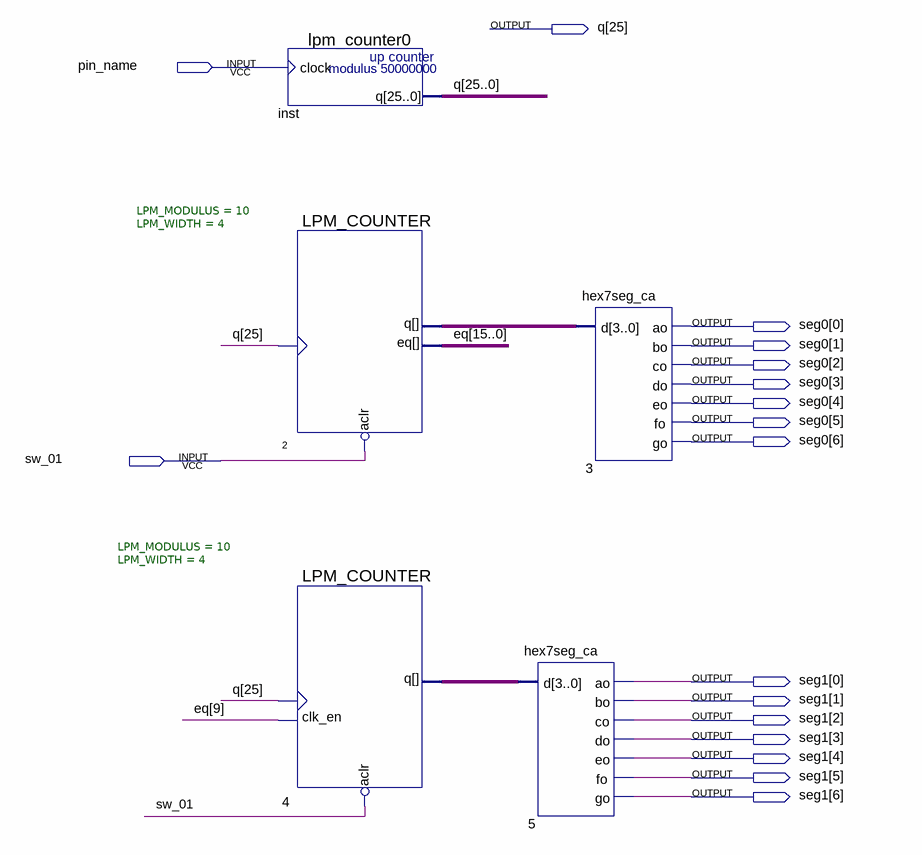
[diagram p0: schematic sheet]
// Quartus schematic lpm_lab_02.bdf as structural Verilog: 5 symbols, 17 pins
module lpm_lab_02 (
  input  pin_name,
  input  sw_01,
  output [25:0] q,
  output [6:0] seg0,
  output [6:0] seg1
);

  wire [3:0] n2_q, n4_q;
  wire [15:0] eq;

  lpm_counter0 inst (.clock(pin_name), .q(q));
  LPM_COUNTER #(.LPM_MODULUS(10), .LPM_WIDTH(4)) u_2 (.clock(q[25]), .aclr(~sw_01), .q(n2_q), .eq(eq));
  LPM_COUNTER #(.LPM_MODULUS(10), .LPM_WIDTH(4)) u_4 (.clock(q[25]), .clk_en(eq[9]), .aclr(~sw_01), .q(n4_q));
  hex7seg_ca u_5 (
    .d(n4_q), .ao(seg1[0]), .bo(seg1[1]), .co(seg1[2]), .\do (seg1[3]), .eo(seg1[4]), .fo(seg1[5]),
    .go(seg1[6]));
  hex7seg_ca u_3 (
    .d(n2_q), .ao(seg0[0]), .bo(seg0[1]), .co(seg0[2]), .\do (seg0[3]), .eo(seg0[4]), .fo(seg0[5]),
    .go(seg0[6]));
endmodule
